# EasyEDA schematic Prática-06.json

## Sheets
1 Sheet_1: TITLE: Sheet_1; REV: 1.0; Date: 2020-09-28; Sheet: 1/1; Company: Your Company
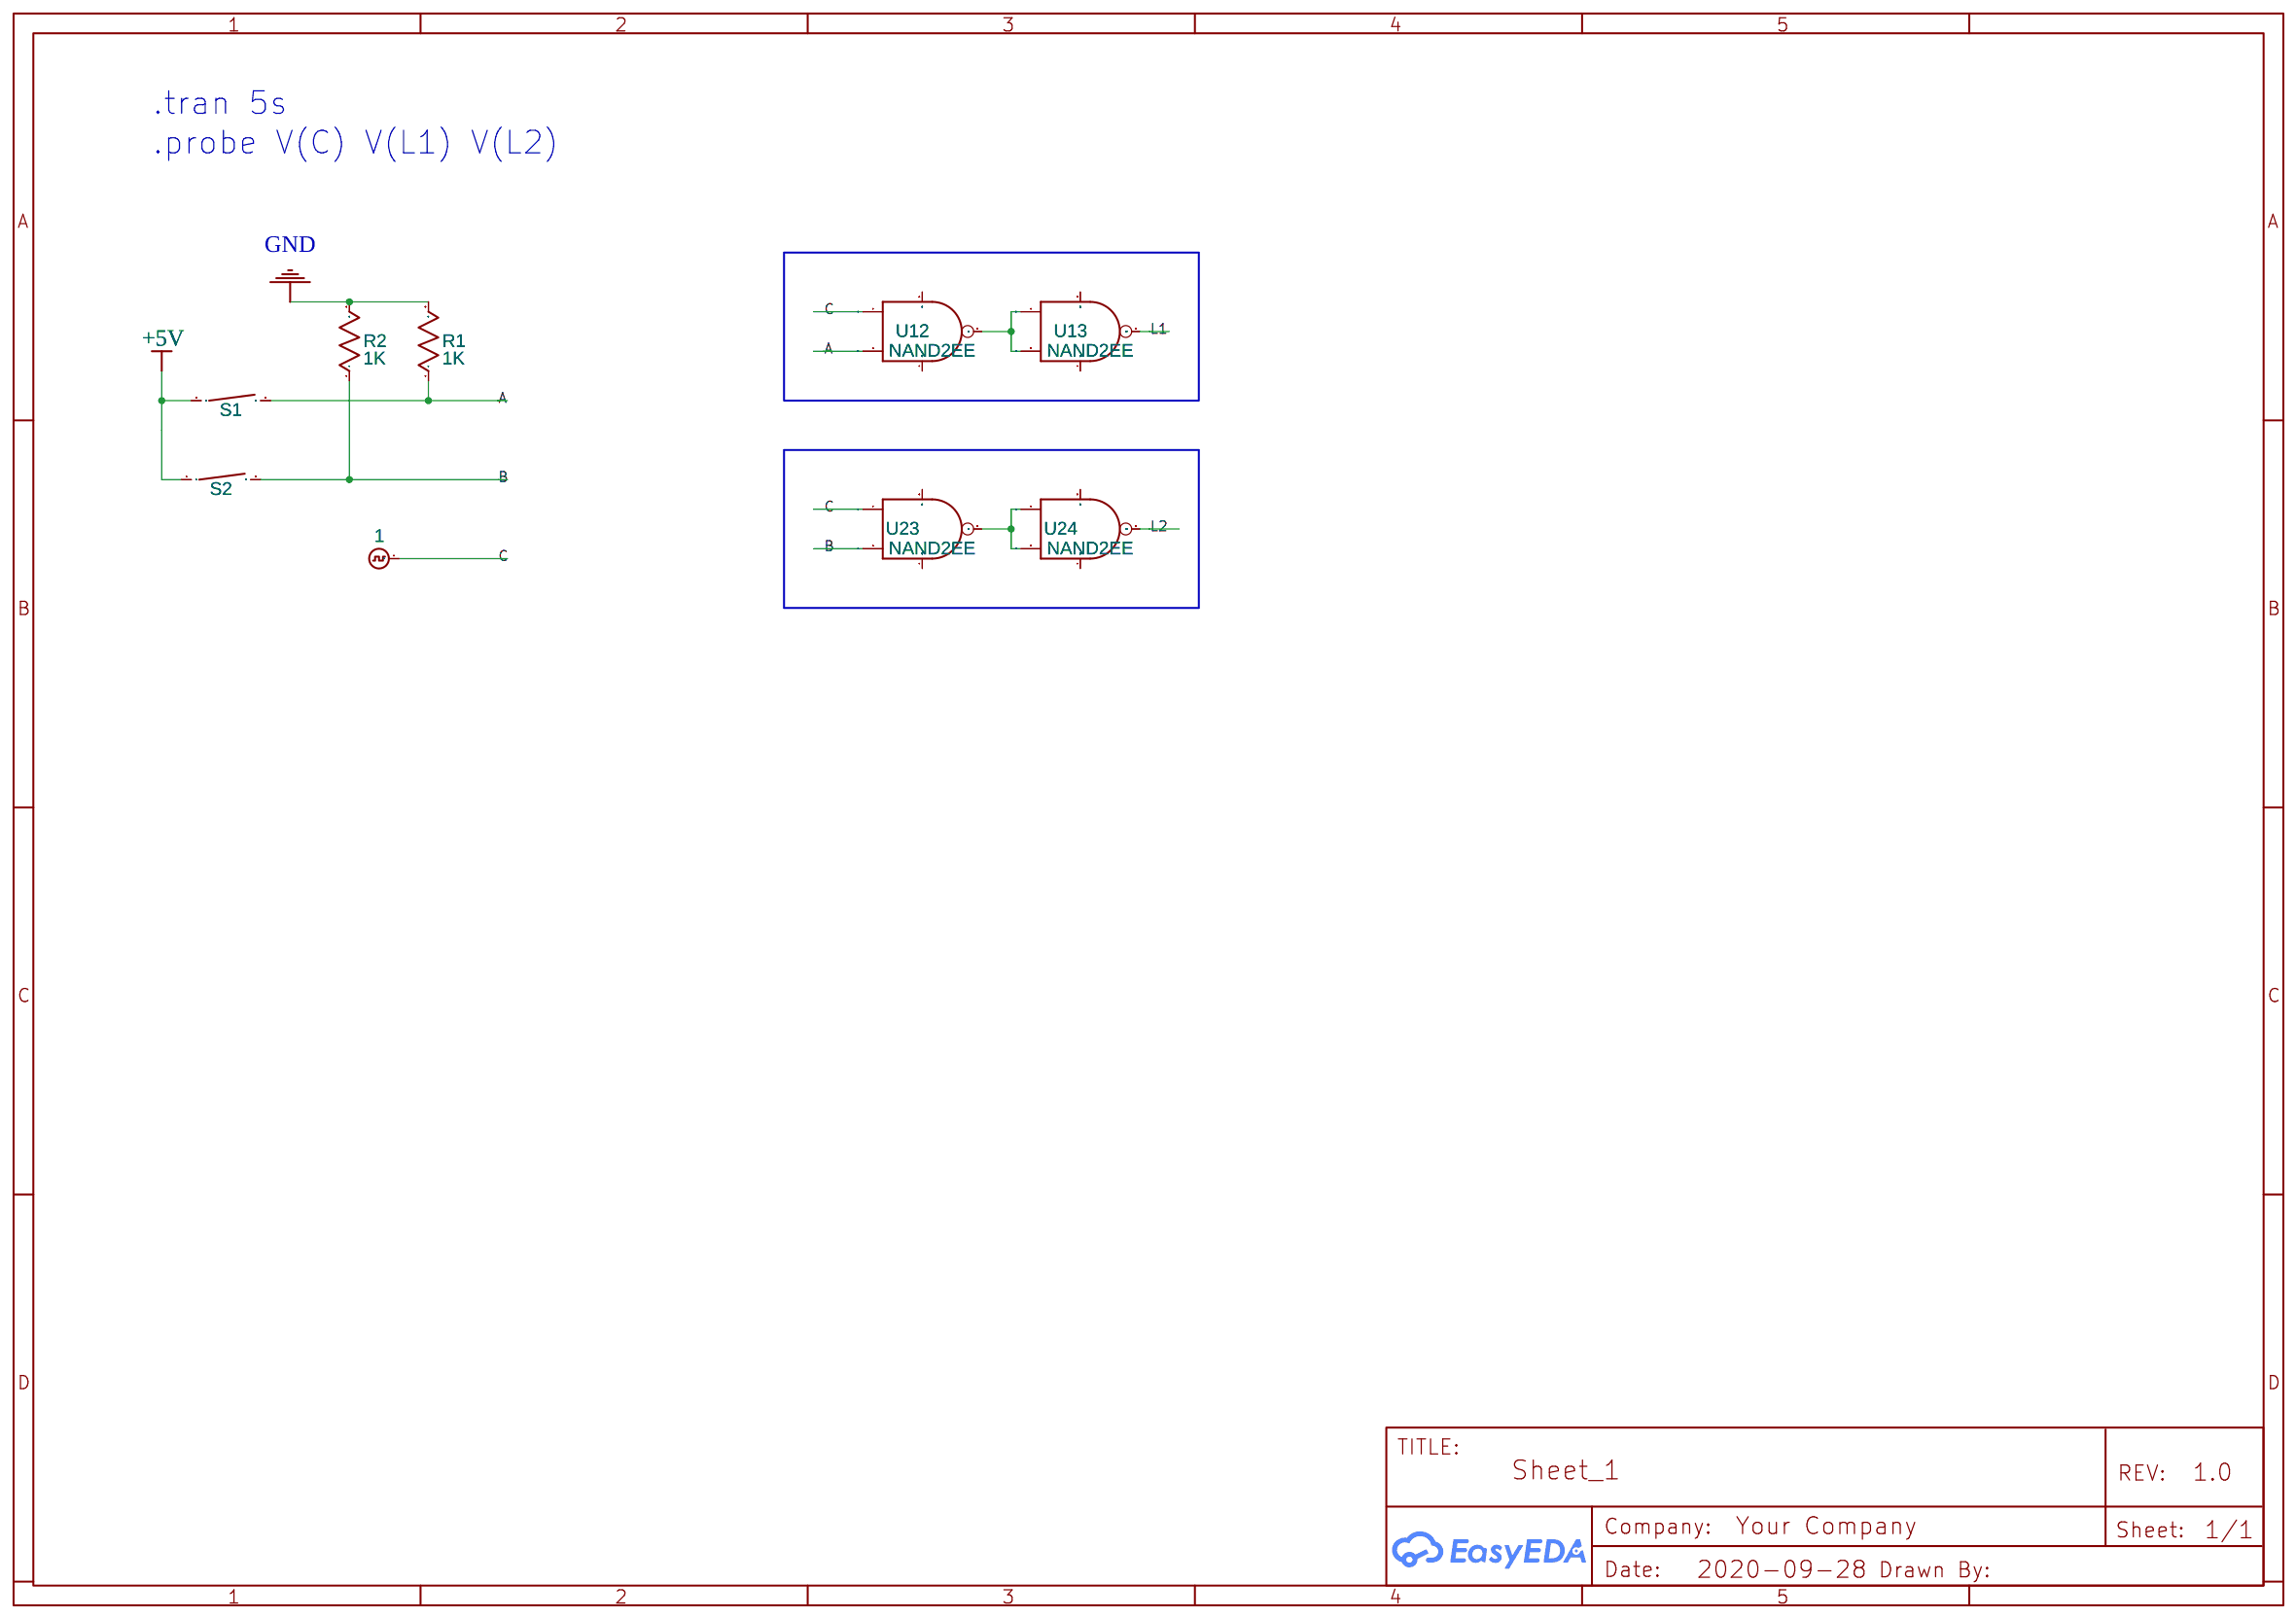
[diagram p0: Sheet_1]
2 Sheet_2: TITLE: Sheet_2; Date: 2020-09-30
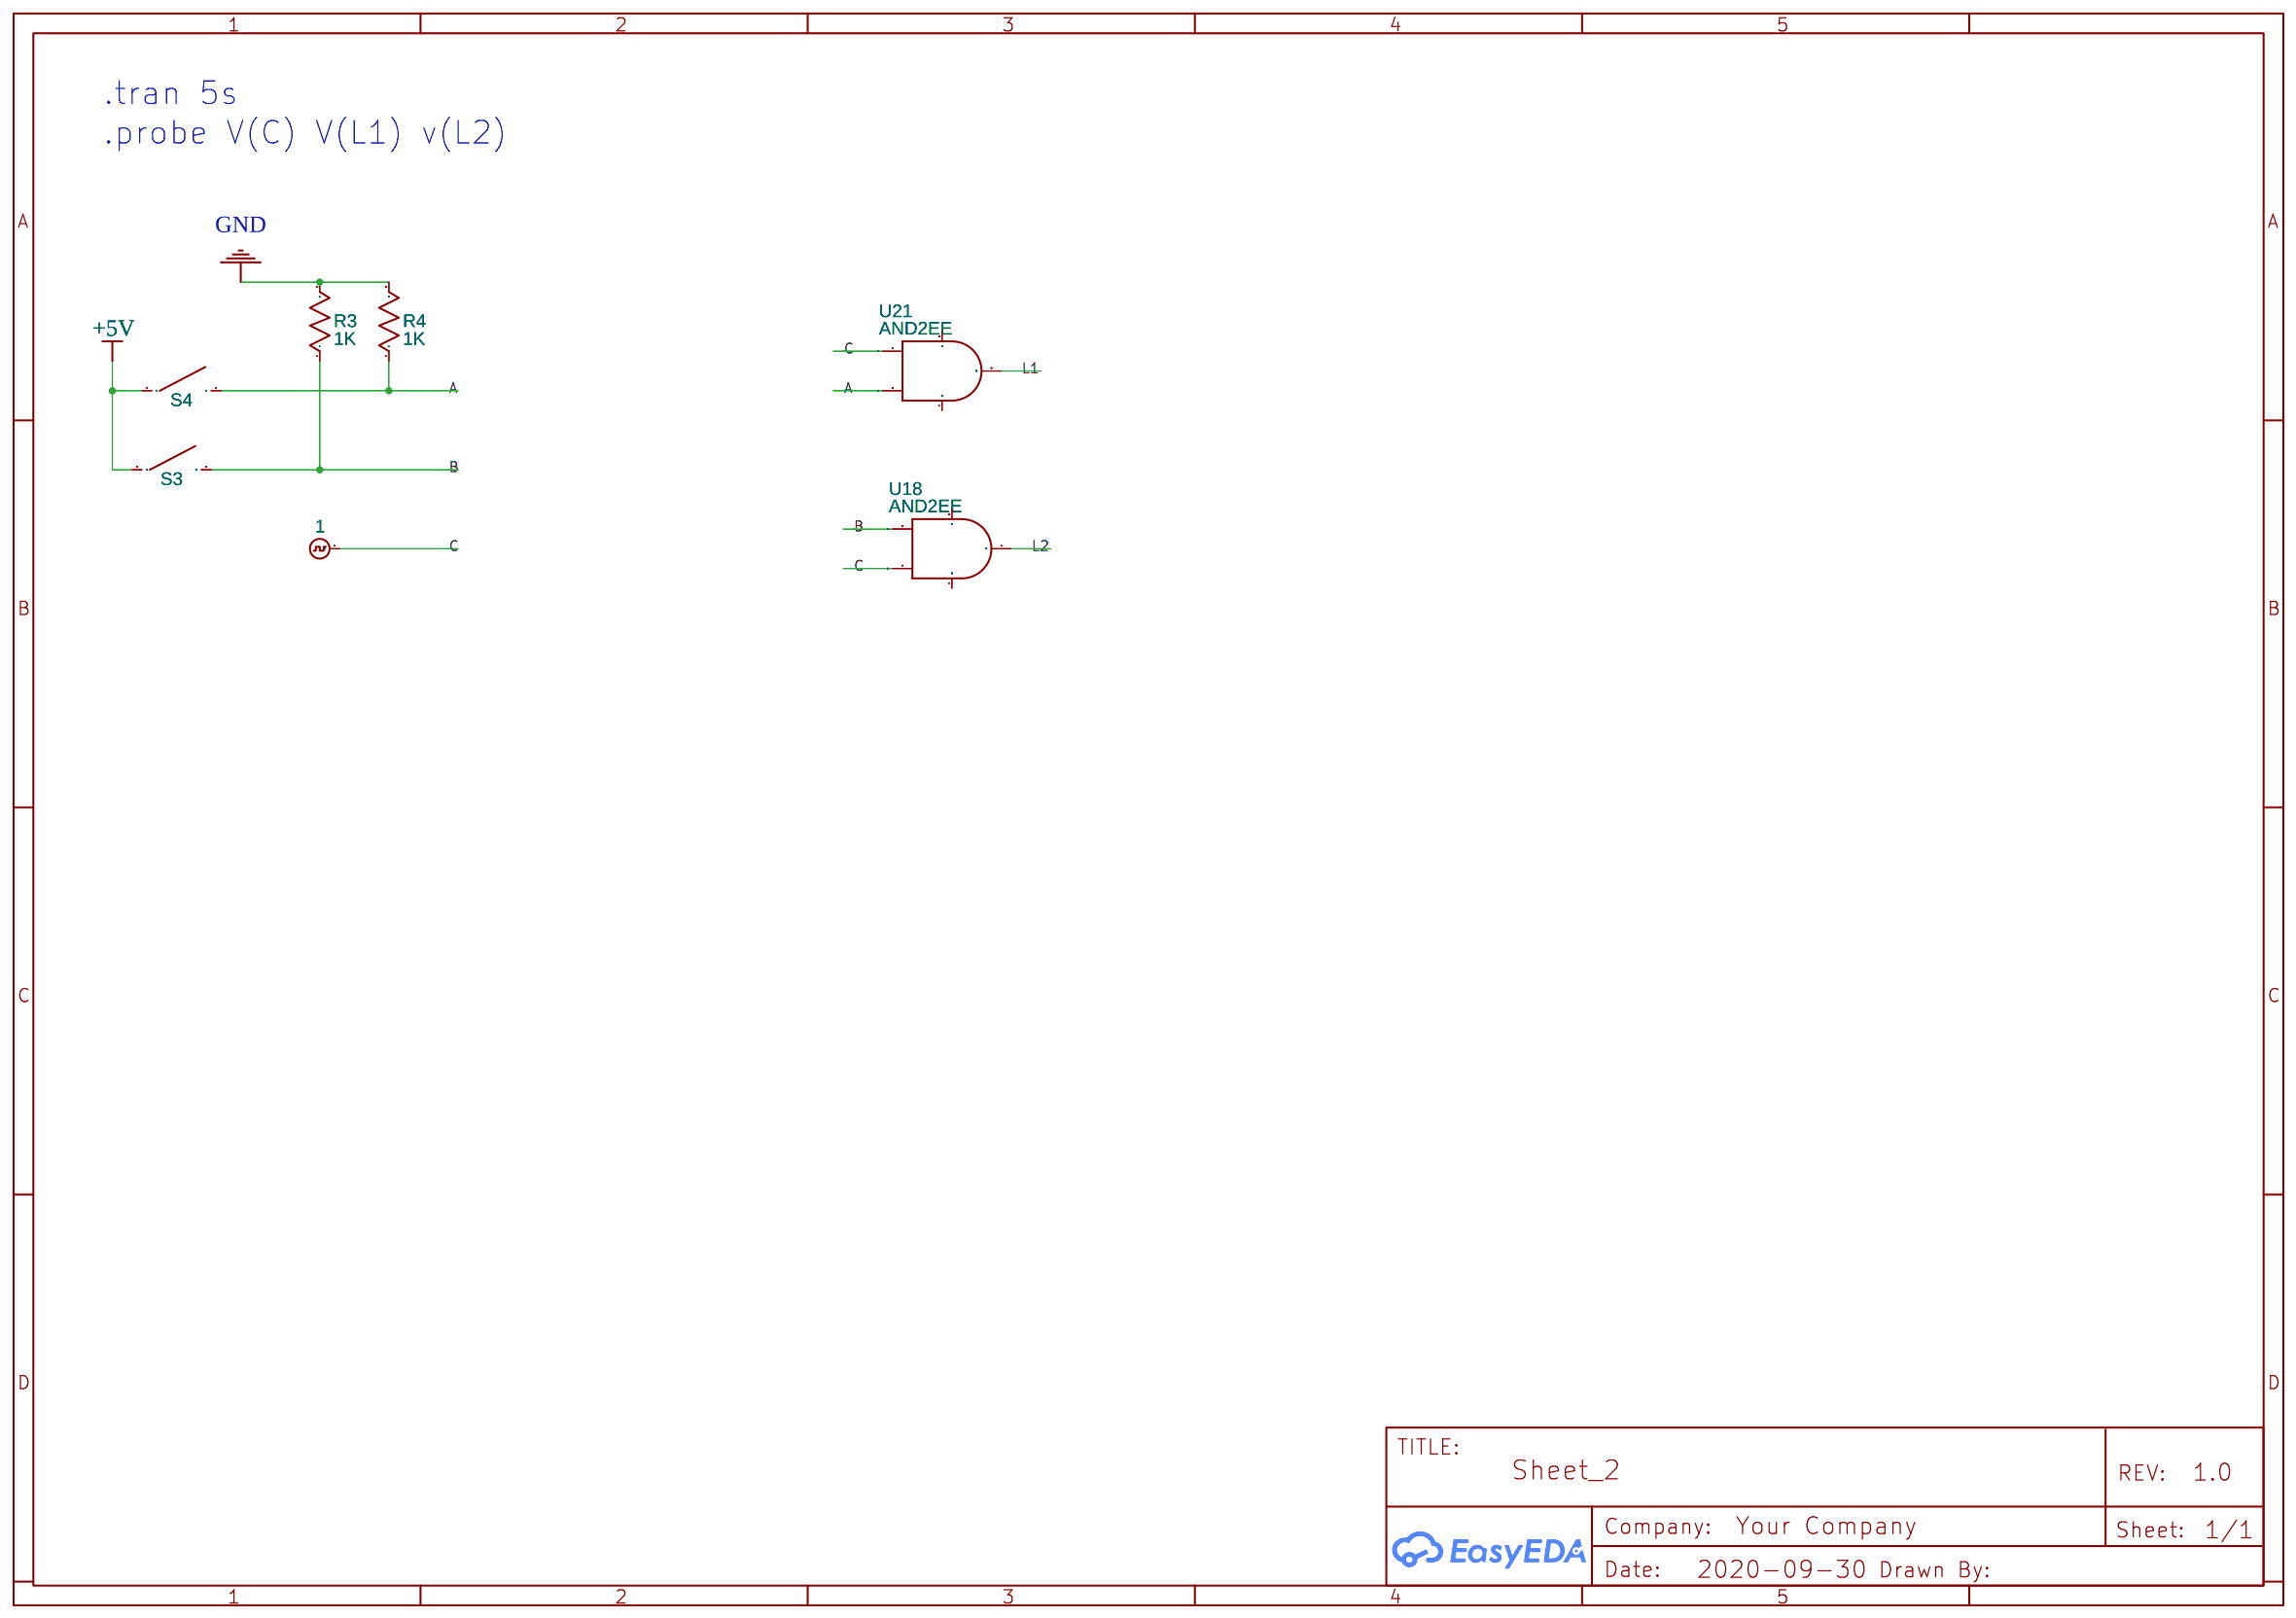
[diagram p1: Sheet_2]

## Parts
sheet Sheet_1
R1  1K  [AXIAL-0.3]
R2  1K  [AXIAL-0.3]
S1  SPST_Open
S2  SPST_Open
U2  1
U12  NAND2EE
U13  NAND2EE
U23  NAND2EE
U24  NAND2EE
sheet Sheet_2
R3  1K  [AXIAL-0.3]
R4  1K  [AXIAL-0.3]
S3  SPST_Open
S4  SPST_Open
U14  1
U18  AND2EE
U21  AND2EE

## Library data of the parts
R1-R4 = Resistor_US: Resistance: 1k; Contributor: EasyEDA; Supplier: YUJING
S1 S2 = SPST: catid: 20; State: Close; Contributor: EasyEDA; NameDisplay: 0
U2 U14 = DIGITALCLOCK: Contributor: EasyEDA; PreDisplay: 0
U12 U13 U18 U21 U23 U24 = LOGIC: Contributor: EasyEDA
S3 S4 = SPST: catid: 20; State: Open; Contributor: EasyEDA; NameDisplay: 0

## Nets
+5V: S1.1 S2.1 S3.1 S4.1
GND: R1.2 R2.2 R3.2 R4.2
A: R1.1 R4.1 S1.2 S4.2 U12.2(INB) U21.2(INB)
B: R2.1 R3.1 S2.2 S3.2 U18.1(INA) U23.2(INB)
C: U2.1 U12.1(INA) U14.1 U18.2(INB) U21.1(INA) U23.1(INA)
L1: U13.5(OUT) U21.5(OUT)
L2: U18.5(OUT) U24.5(OUT)
Net-(U12-5): U12.5(OUT) U13.1(INA) U13.2(INB)
Net-(U23-5): U23.5(OUT) U24.1(INA) U24.2(INB)

Not connected (* = marked no-connect by the designer): U12 3(VDD) 4(GND); U13 3(VDD) 4(GND); U18 3(VDD) 4(GND); U21 3(VDD) 4(GND); U23 3(VDD) 4(GND); U24 3(VDD) 4(GND)

## Notes on the sheets
sheet 1
- .tran 5s
- .probe V(C) V(L1) V(L2)
sheet 2
- .tran 5s
- .probe V(C) V(L1) v(L2)
